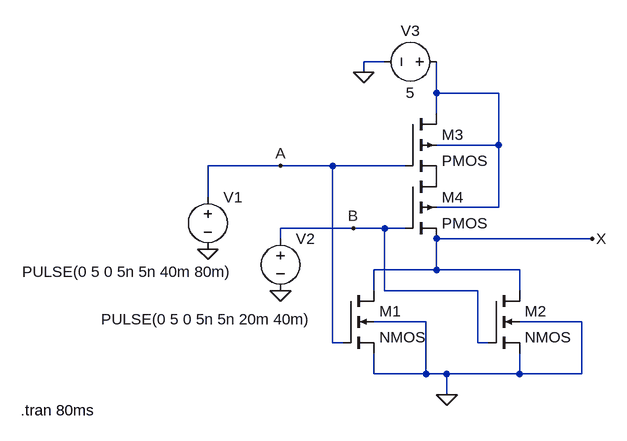
[diagram p0: schematic CMOS NOR.asc]
CMOS NOR.asc, the LTspice schematic file:
Version 4
SHEET 1 880 680
WIRE 224 -240 192 -240
WIRE 192 -224 192 -240
WIRE 304 -192 304 -240
WIRE 400 -192 304 -192
WIRE 304 -160 304 -192
WIRE 400 -112 400 -192
WIRE 400 -112 304 -112
WIRE 64 -80 -48 -80
WIRE 144 -80 64 -80
WIRE 256 -80 144 -80
WIRE -48 -32 -48 -80
WIRE 400 -16 400 -112
WIRE 400 -16 304 -16
WIRE 176 16 64 16
WIRE 224 16 176 16
WIRE 256 16 224 16
WIRE 64 32 64 16
WIRE 544 32 304 32
WIRE 304 80 304 32
WIRE 304 80 208 80
WIRE 432 80 304 80
WIRE 208 112 208 80
WIRE 224 112 224 16
WIRE 368 112 224 112
WIRE 432 112 432 80
WIRE 288 160 208 160
WIRE 528 160 432 160
WIRE 144 192 144 -80
WIRE 160 192 144 192
WIRE 368 192 368 112
WIRE 384 192 368 192
WIRE 208 240 208 208
WIRE 288 240 288 160
WIRE 288 240 208 240
WIRE 320 240 288 240
WIRE 432 240 432 208
WIRE 432 240 320 240
WIRE 528 240 528 160
WIRE 528 240 432 240
WIRE 320 272 320 240
FLAG -48 48 0
FLAG 64 112 0
FLAG 320 272 0
FLAG 192 -224 0
FLAG 544 32 X
FLAG 64 -80 A
FLAG 176 16 B
SYMBOL nmos4 160 112 R0
SYMATTR InstName M1
SYMBOL nmos4 384 112 R0
SYMATTR InstName M2
SYMBOL pmos4 256 -160 R0
SYMATTR InstName M3
SYMBOL pmos4 256 -64 R0
SYMATTR InstName M4
SYMBOL voltage -48 -48 R0
WINDOW 3 -286 131 Left 2
WINDOW 123 0 0 Left 0
WINDOW 39 0 0 Left 0
SYMATTR InstName V1
SYMATTR Value PULSE(0 5 0 5n 5n 40m 80m)
SYMBOL voltage 64 16 R0
WINDOW 3 -276 140 Left 2
WINDOW 123 0 0 Left 0
WINDOW 39 0 0 Left 0
SYMATTR InstName V2
SYMATTR Value PULSE(0 5 0 5n 5n 20m 40m)
SYMBOL voltage 320 -240 R90
WINDOW 0 -32 56 VBottom 2
WINDOW 3 32 56 VTop 2
WINDOW 123 0 0 Left 0
WINDOW 39 0 0 Left 0
SYMATTR InstName V3
SYMATTR Value 5
TEXT -336 296 Left 2 !.tran 80ms

The netlist it stands for:
* CMOS NOR.asc
M1 X A 0 0 NMOS
M2 X B 0 0 NMOS
M3 N001 A P001 N001 PMOS
M4 P001 B X N001 PMOS
V1 A 0 PULSE(0 5 0 5n 5n 40m 80m)
V2 B 0 PULSE(0 5 0 5n 5n 20m 40m)
V3 N001 0 5
.model NMOS NMOS
.model PMOS PMOS
.lib standard.mos
.tran 80ms
.backanno
.end